# Altium project HUP.PrjPcb
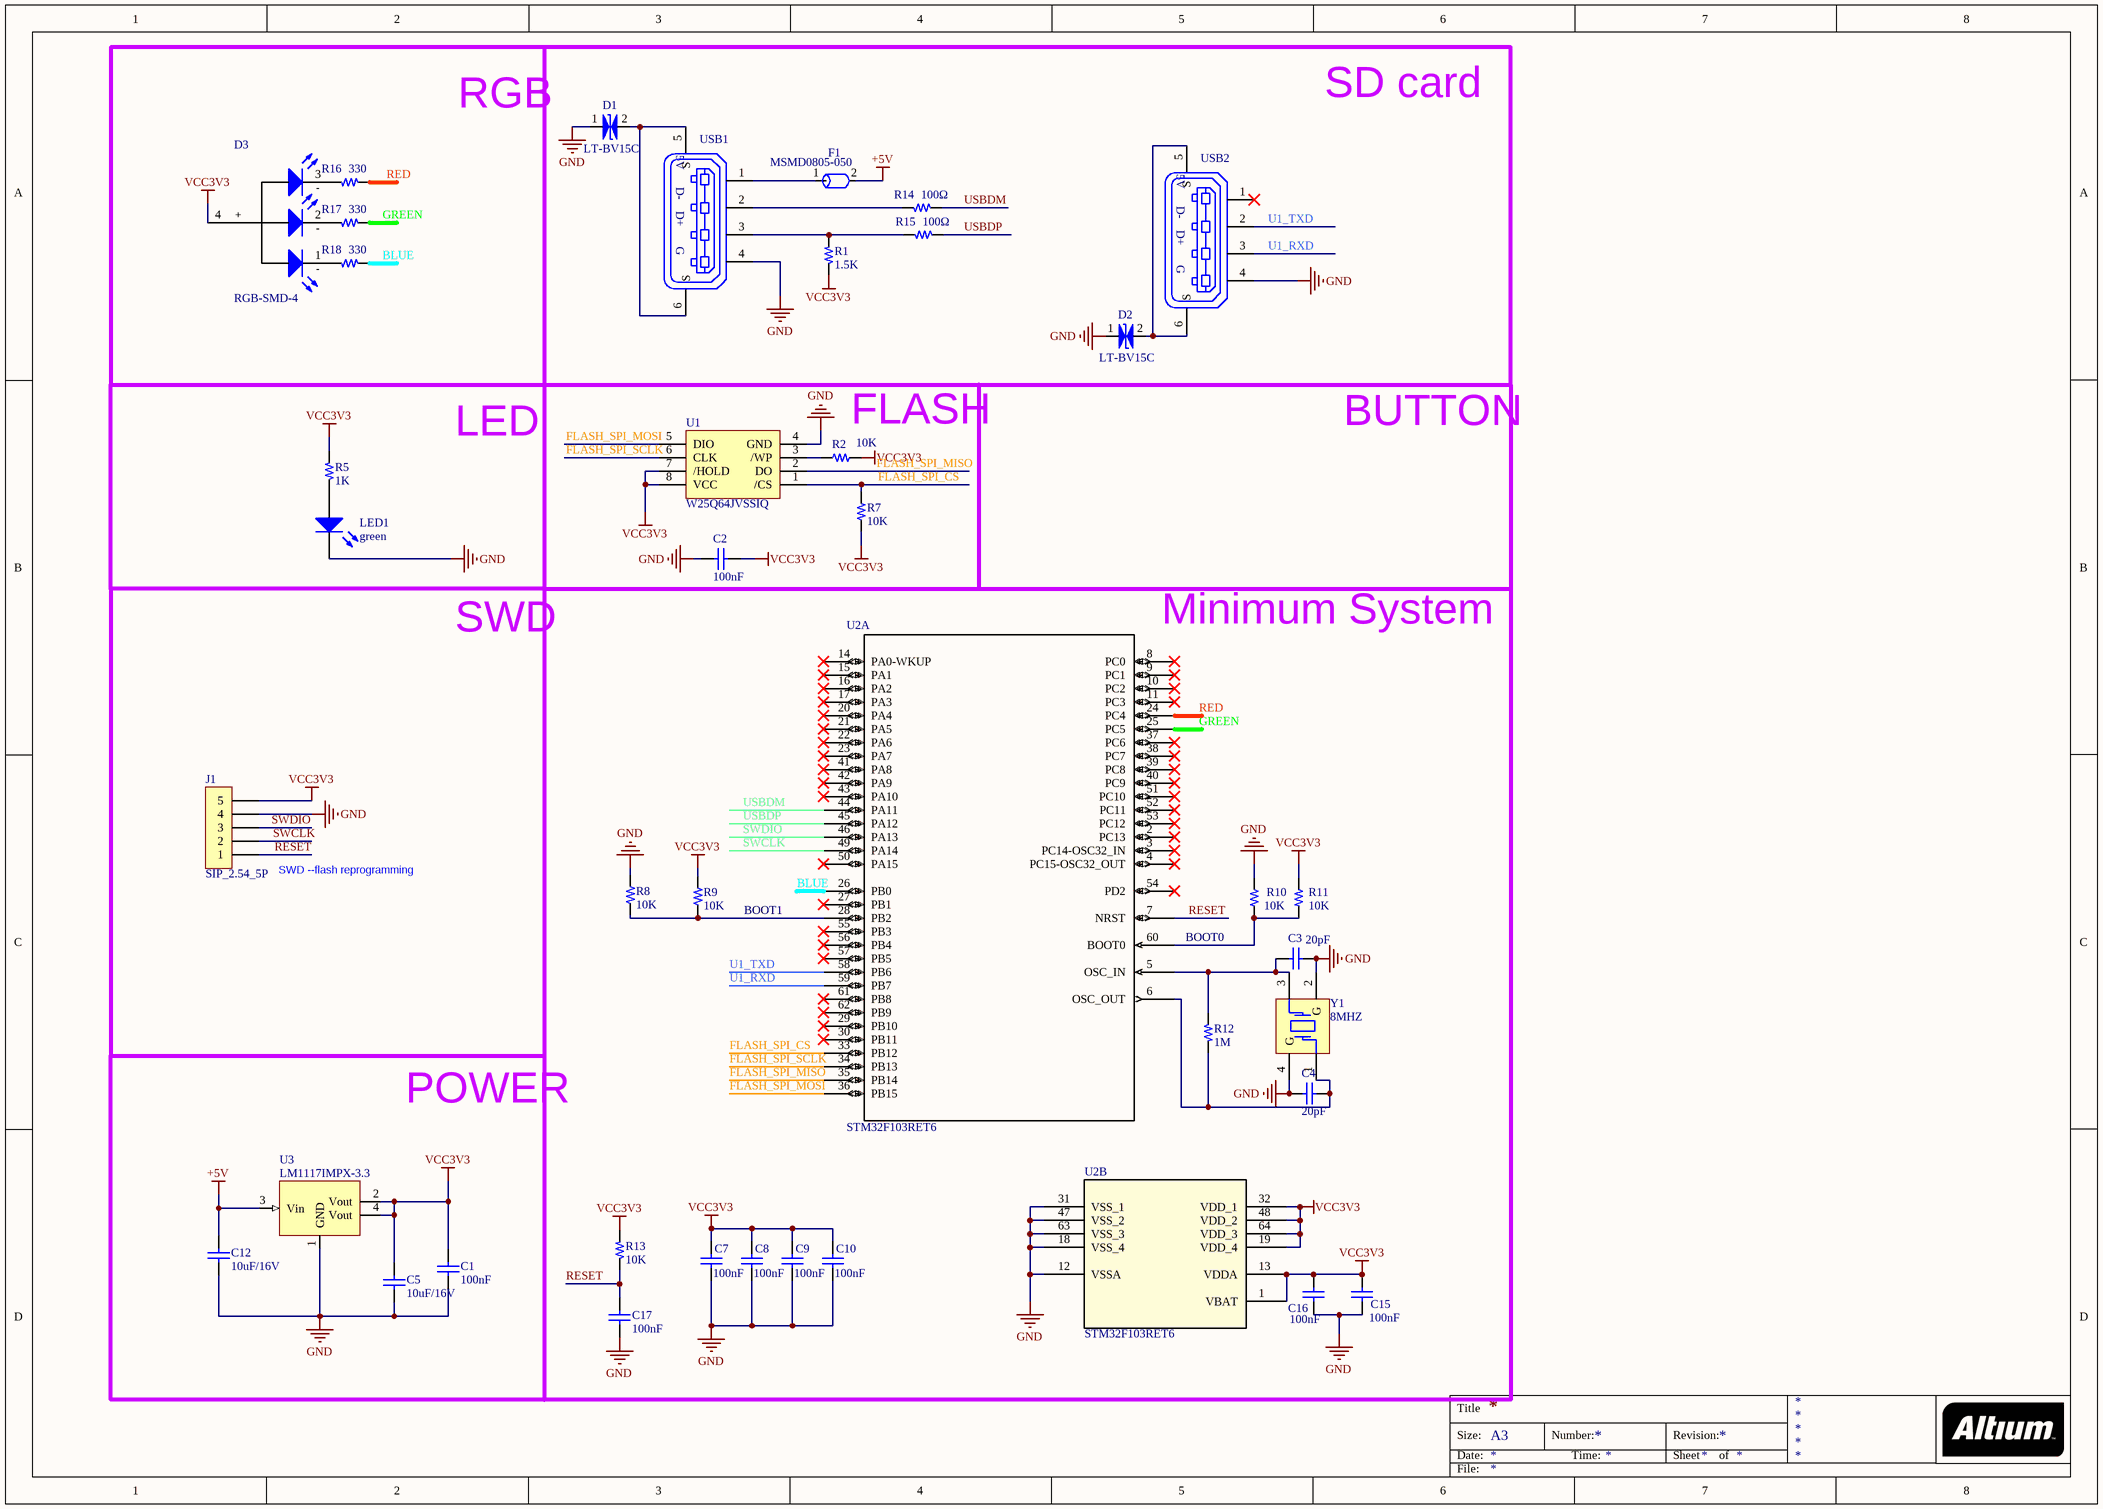
[diagram p0: HUP.SchDoc]
1 sheet, 40 parts. Net scope: global (net labels, ports and power ports of the same name join across sheets).
Board file: HUP2.PcbDoc

## Sheet HUP.SchDoc
size A3

### Parts
C1  100nF  [C-0603]
C2  100nF  [C-0603]
C3  20pF  [C-0603]
C4  20pF  [C-0603]
C5  10uF/16V  [C-0603]
C7  100nF  [C-0603]
C8  100nF  [C-0603]
C9  100nF  [C-0603]
C10  100nF  [C-0603]
C12  10uF/16V  [C-0603]
C15  100nF  [C-0603]
C16  100nF  [C-0603]
C17  100nF  [C-0603]
D1  LT-BV15C  [SOD323T]
D2  LT-BV15C  [SOD323T]
D3  RGB-SMD-4
F1  MSMD0805-050  [R0805]
J1  SIP_2.54_5P  [SIP_2.54_5P]
LED1  green  [0603_LED_S1]
R1  1.5K  [R-0603]
R2  10K  [R-0603]
R5  1K  [R-0603]
R7  10K  [R-0603]
R8  10K  [R-0603]
R9  10K  [R-0603]
R10  10K  [R-0603]
R11  10K  [R-0603]
R12  1M  [R-0603]
R13  10K  [R-0603]
R14  100Ω  [R-0603]
R15  100Ω  [R-0603]
R16  330  [R-0603]
R17  330  [R-0603]
R18  330  [R-0603]
U1  W25Q64JVSSIQ  [W25Q64JVSSIQ]
U2  STM32F103RET6  [LQFP64-10x10mm]  (parts A,B of 2)
U3  LM1117IMPX-3.3  [SOT223]
USB1  USB  [USB-A-Plug-2]  (value not drawn)
USB2  USB  [USB A Header]  (value not drawn)
Y1  8MHZ  [TAS3225]

### Nets
+5V: C12.1 F1.2 U3.3(Vin)
GND: C1.1 C2.2 C3.1 C4.2 C5.2 C7.1 C8.1 C9.1 C10.1 C12.2 C15.2 C16.1 C17.2 D1.1 D2.1 J1.4 LED1.2(K) R8.1(TOP) R10.1(TOP) U1.4(GND) U2.12(VSSA) U2.18(VSS_4) U2.31(VSS_1) U2.47(VSS_2) U2.63(VSS_3) U3.1(GND) USB1.4 USB2.4 Y1.2(G) Y1.4(G)
VCC3V3: C1.2 C2.1 C5.1 C7.2 C8.2 C9.2 C10.2 C15.1 C16.2 D3.4 J1.5 R1.1(TOP) R2.1(TOP) R5.2(BOT) R7.1(TOP) R9.1(TOP) R11.1(TOP) R13.2(BOT) U1.7(/HOLD) U1.8(VCC) U2.1(VBAT) U2.13(VDDA) U2.19(VDD_4) U2.32(VDD_1) U2.48(VDD_2) U2.64(VDD_3) U3.2(Vout) U3.4(Vout)
BLUE: R18.1(TOP) U2.26(PB0)
BOOT0: R10.2(BOT) R11.2(BOT) U2.60(BOOT0)
BOOT1: R8.2(BOT) R9.2(BOT) U2.28(PB2)
FLASH_SPI_CS: R7.2(BOT) U1.1(/CS) U2.33(PB12)
FLASH_SPI_MISO: U1.2(DO) U2.35(PB14)
FLASH_SPI_MOSI: U1.5(DIO) U2.36(PB15)
FLASH_SPI_SCLK: U1.6(CLK) U2.34(PB13)
GREEN: R17.1(TOP) U2.25(PC5)
RED: R16.1(TOP) U2.24(PC4)
RESET: C17.1 J1.1 R13.1(TOP) U2.7(NRST)
SWCLK: J1.2 U2.49(PA14)
SWDIO: J1.3 U2.46(PA13)
U1_RXD: U2.59(PB7) USB2.3
U1_TXD: U2.58(PB6) USB2.2
USBDM: R14.1(TOP) U2.44(PA11)
USBDP: R15.1(TOP) U2.45(PA12)
NetC3_2: C3.2 R12.2(BOT) U2.5(OSC_IN) Y1.3
NetC4_1: C4.1 R12.1(TOP) U2.6(OSC_OUT) Y1.1
NetD1_2: D1.2 USB1.5(S) USB1.6(S)
NetD2_2: D2.2 USB2.5(S) USB2.6(S)
NetD3_1: D3.1 R18.2(BOT)
NetD3_2: D3.2 R17.2(BOT)
NetD3_3: D3.3 R16.2(BOT)
NetF1_1: F1.1 USB1.1
NetLED1_1: LED1.1(A) R5.1(TOP)
NetR1_2: R1.2(BOT) R15.2(BOT) USB1.3
NetR2_2: R2.2(BOT) U1.3(/WP)
NetR14_2: R14.2(BOT) USB1.2

Not connected (* = marked no-connect by the designer): U2 2(PC13)* 3(PC14-OSC32_IN)* 4(PC15-OSC32_OUT)* 8(PC0)* 9(PC1)* 10(PC2)* 11(PC3)* 14(PA0-WKUP)* 15(PA1)* 16(PA2)* 17(PA3)* 20(PA4)* 21(PA5)* 22(PA6)* 23(PA7)* 27(PB1)* 29(PB10)* 30(PB11)* 37(PC6)* 38(PC7)* 39(PC8)* 40(PC9)* 41(PA8)* 42(PA9)* 43(PA10)* 50(PA15)* 51(PC10)* 52(PC11)* 53(PC12)* 54(PD2)* 55(PB3)* 56(PB4)* 57(PB5)* 61(PB8)* 62(PB9)*; USB2 1*

### Notes on the sheet
- RGB
- SD card
- LED
- (near R2) FLASH
- BUTTON
- SWD
- (near U2) Minimum System
- (near J1) SWD --flash reprogramming
- POWER
- Title
- Size:
- Date:
- A3
- Number:
- Time:
- Revision:
- Sheet
- of
- File:
- (in symbol RGB) -; +
- (in symbol USB_A) 5V; D-; D+; G

### Library data of the parts
C1 C7-C10 = 100nF_0805: 物料编号: 210001894; 详细描述: X7R,50V,三星CL21B104JBCNNNC; 版本: V1.00; 名称: 贴片瓷介电容100nF±5%,0805; 制造商: 三星
C2 = 100nF_0805: 规格/型号: 封装0603,精度10%,型号CL10B104KB8NNNC; 详细描述: 0.1UF/50V,10%,0603，三星; 名称: 电容0.1UF/50V; 制造商: 三星
C3 C4 C17 = 20pF_0805: 物料编号: 210000302; 详细描述: C0G,50V,CL21C200JBANNNC; 制造商: 三星; 版本: V1.00; 名称: 贴片瓷介电容20pF±5%,0805
C5 C12 = 10uF_0805: 物料编号: 210003505; 详细描述: X5R,10V,TDK,C2012X5R1A106K; 版本: V1.00; 名称: 贴片瓷介电容10uF±10%,0805; 制造商: TDK
C15 = 1uF_0805: 物料编号: 210000394; 详细描述: X7R,50V,三星CL21B105KBFNNNE; 版本: V1.00; 名称: 贴片瓷介电容1uF±10%,0805; 制造商: 三星
C16 = 10nF_0805: 物料编号: 210001895; 详细描述: X7R,50V,三星CL21B103KBANNNC; 版本: V1.00; 名称: 贴片瓷介电容10nF±10%,0805; 制造商: 三星
D1 D2 = LTBV05C: 详细描述: 5uA  肖特基二极管 ，VRRM=15.0V; 名称: 二极管; 制造商: 深圳市浪拓电子技术有限公司; 规格/型号: 封装SOD323T,型号LT-BV15C
D3 = RGB
F1 = FB_1K/500mA_0805: 名称: 磁珠600Ω@100MHz; 详细描述: 0805封装,阻抗600Ω@100MHz,直流电阻0.1Ω,额定电流2A; 制造商: TDK; 规格/型号: 封装0805,型号MPZ2012S601AT000
J1 = SIP_2.54_5P: 名称: 接插件; 详细描述: 直插，间距2.54，2pin
LED1 = LED1: 规格/型号: 封装0603,高度0.4mm,19-217_GHC-YN2Q1QY_3T; 制造商: 光辉电子; 详细描述: LED，绿色; 名称: 贴片绿色LED
R1 R8-R11 R13-R18 = 10K±1%_0805: 版本: V1.00; 名称: 贴片电阻10K±1%; 物料编号: 210001830; 详细描述: 0805,1/8W,国巨RC0805FR-0710KL; 制造商: 国巨
R2 R7 = 4.7K±1%_0805: 规格/型号: 封装0603,精度1%,型号RC0603FR-0710KL; 详细描述: 0603封装，1%,10K,1/10W,国巨; 名称: 电阻10KΩ; 制造商: 国巨
R5 = 1K±1%_0805: 物料编号: 210001832; 详细描述: 0805,1/8W,国巨RC0805FR-071KL; 制造商: 国巨; 版本: V1.00; 名称: 贴片电阻1K±1%
R12 = 1M±1%_0805: 物料编号: 210000749; 详细描述: 0805,1/8W,国巨RC0805FR-071ML; 制造商: 国巨; 版本: V1.00; 名称: 贴片电阻1M±1%
U1 = W25Q64JVSSIQ: 详细描述: SPI Flash,64M-bit,8-pin,SOIC 208-mil; 规格/型号: 封装SOIC,8Pin,型号W25Q64JVSSIQ; 名称: 芯片; 制造商: 华邦电子
U2 = STM32F10xRxT2: Imported; Vendor: STMicroelectronics; C: Copyright (C) 2016 Accelerated Designs. All rights reserved; Manufacturer_Part_Number: stm32f10xrxt2; Copyright: Copyright (C) 2016 Accelerated Designs. All rights reserved; RefDes: RefDes; Type: Type; Value: Value
U3 = LM1117IMPX-3.3: 名称: 芯片LM1117IMPX-3.3; 物料编号: 210001697; 详细描述: 3.3V 输出LDO, 工业级 ,SOT223; 版本: V1.00; 制造商: NS
USB1 USB2 = USB_A: 名称: A型USB插座; 规格/型号: 封装USB-A,型号USB-A-R-1; 详细描述: 单体,直插,侧向接入; 制造商: 深圳市南士科技股份有限公司
Y1 = 泰艺5032晶振8MHz: 版本: V1.00; 名称: 晶振8MHz; 详细描述: 4脚表贴无源晶振,，5032封装，±30ppm; 制造商: 泰艺